# Altium schematic sheet STM32G4_microcontroller.SchDoc
size 420 x 297 mm; SheetNumber: 3; SheetTotal: 9
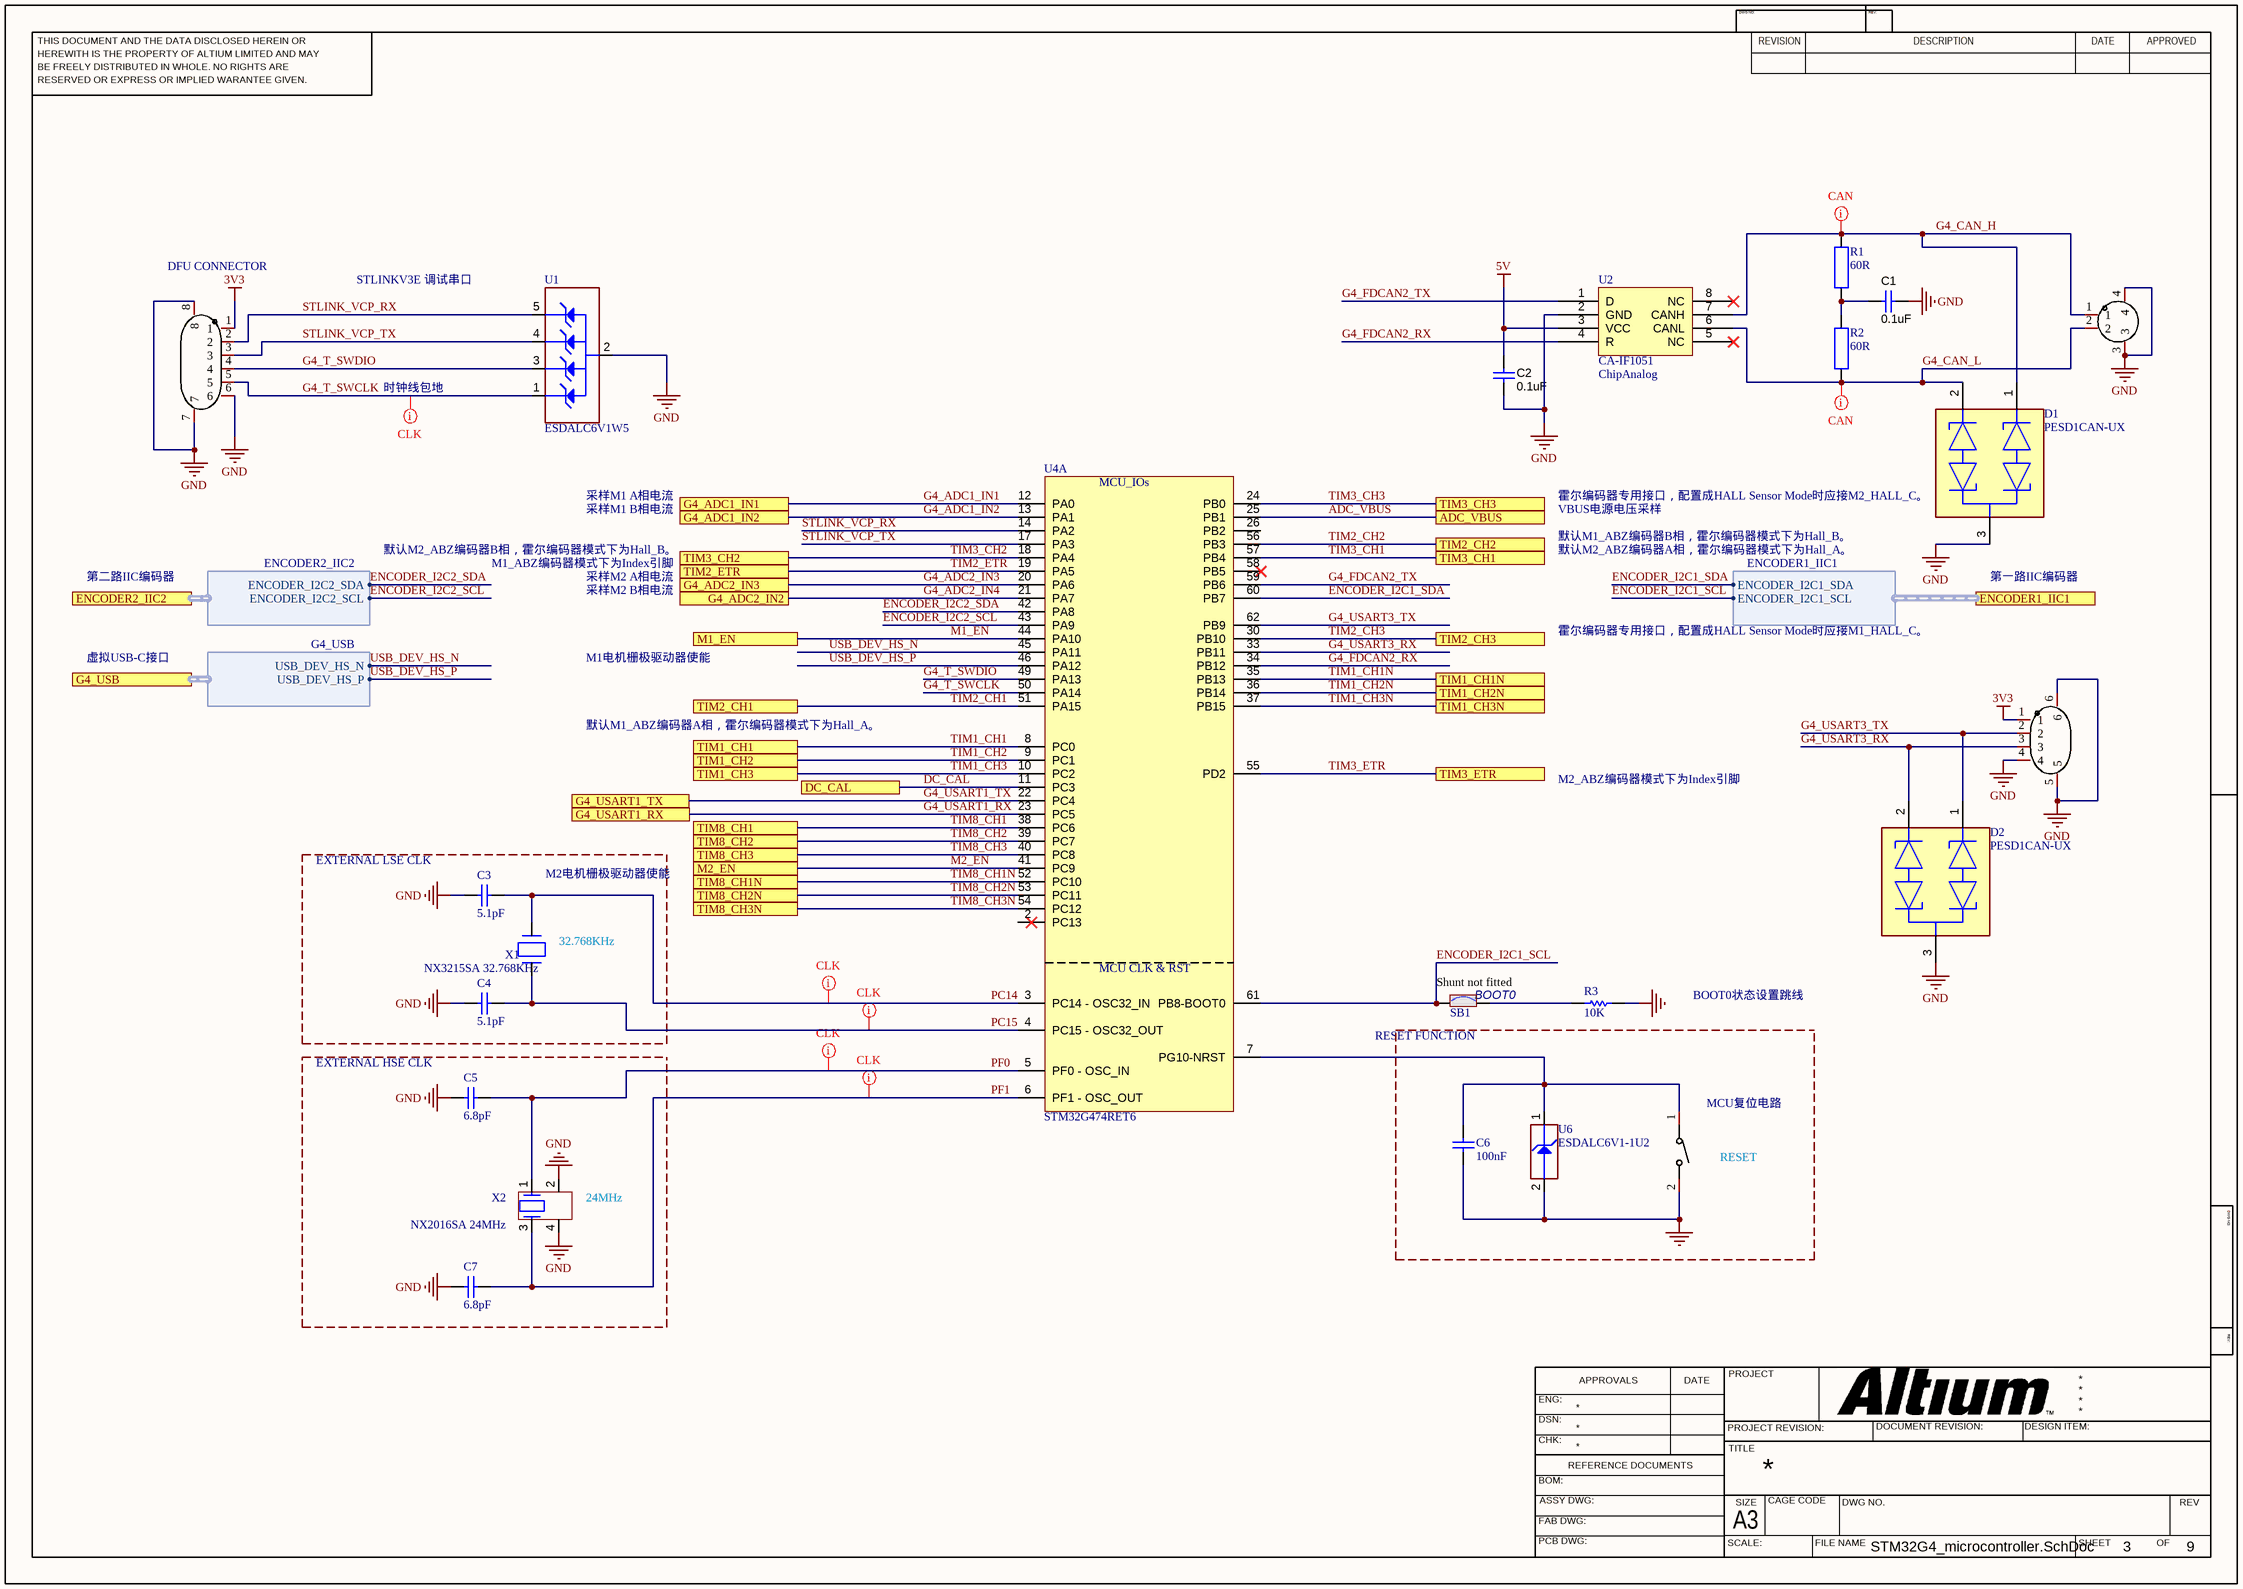
[diagram p0: STM32G4_microcontroller.SchDoc]

## Parts
C1  ValueDisplayed: 0.1uF  [0603L]  (hidden comment: GRM188R61E105KA12D)
C2  ValueDisplayed: 0.1uF  [0603L]  (hidden comment: GRM188R61E105KA12D)
C3  value 5.1pF  [C0402]
C4  value 5.1pF  [C0402]
C5  value 6.8pF  [C0402]
C6  value 100nF  [C0402]
C7  value 6.8pF  [C0402]
CN1  WAFER-GH1.25-2PWB  [CONN-TH_2P-P1.25_XUNPU_WAFER-GH1.25-2PWB]  (value not drawn)
D1  PESD1CAN-UX  [FP-SOT323-MFG]
D2  PESD1CAN-UX  [FP-SOT323-MFG]
R1  60R  [RESC1608X55N]
R2  60R  [RESC1608X55N]
R3  value 10K  [R0603]
SB1  MCD-00071  [SOLDER-BRIDGE_R0603-0R]  (value not drawn)
SW1  TS-1088-AR02016  [SW-SMD_L3.9-W3.0-P4.45]  (value not drawn)
U1  value ESDALC6V1W5  [ESD_SOT323-5L]
U2  CA-IF1051  [SOIC127P600X175-8N]
U3  WAFER-GH1.25-6PWB  [CONN-SMD_6P-P1.25_XUNPU_WAFER-GH1.25-6PWB]  (value not drawn)
U4  value STM32G474RET6  [ICC_LQFP64_10X10_P050_SOCKET_YAMAICHI_IC149-064-069-B5_NM]  (part A of 2)
U5  WAFER-GH1.25-4PWB  [CONN-SMD_4P-P1.25_XUNPU_WAFER-GH1.25-4PWB]  (value not drawn)
U6  value ESDALC6V1-1U2  [ESD_ST0201]
X1  value NX3215SA 32.768KHz  [CRY_NX3215SA_2P]
X2  value NX2016SA 24MHz  [CRY_NX2016SA_4P]

## Ports
ADC_VBUS (see STM32G4_DRV8301_hardware_TOP_V1.0[2C]), DC_CAL (see STM32G4_DRV8301_hardware_TOP_V1.0[3C], M1_DRV8301_driver[7D], M2_DRV8301_driver[8D]), ENCODER1_IIC1 (harness ENCODER1_IIC1, see STM32G4_DRV8301_hardware_TOP_V1.0[2C], DRV8301_SENSE[3E]), ENCODER2_IIC2 (harness ENCODER2_IIC2, see STM32G4_DRV8301_hardware_TOP_V1.0[2C], DRV8301_SENSE[3E]), G4_ADC1_IN1 (see STM32G4_DRV8301_hardware_TOP_V1.0[3C]), G4_ADC1_IN2 (see STM32G4_DRV8301_hardware_TOP_V1.0[3C]), G4_ADC2_IN2 (see STM32G4_DRV8301_hardware_TOP_V1.0[3C]), G4_ADC2_IN3 (see STM32G4_DRV8301_hardware_TOP_V1.0[3C]), G4_USART1_RX (see STM32G4_DRV8301_hardware_TOP_V1.0[2C]), G4_USART1_TX (see STM32G4_DRV8301_hardware_TOP_V1.0[2C]), G4_USB (harness G4_USB, see STM32G4_DRV8301_hardware_TOP_V1.0[2C], STM32G4_microcontroller_Power[3D]), M1_EN (see STM32G4_DRV8301_hardware_TOP_V1.0[3C]), M2_EN (see STM32G4_DRV8301_hardware_TOP_V1.0[3C]), TIM1_CH1 (see STM32G4_DRV8301_hardware_TOP_V1.0[3C]), TIM1_CH1N (see STM32G4_DRV8301_hardware_TOP_V1.0[3C]), TIM1_CH2 (see STM32G4_DRV8301_hardware_TOP_V1.0[3C]), TIM1_CH2N (see STM32G4_DRV8301_hardware_TOP_V1.0[3C]), TIM1_CH3 (see STM32G4_DRV8301_hardware_TOP_V1.0[3C]), TIM1_CH3N (see STM32G4_DRV8301_hardware_TOP_V1.0[3C]), TIM2_CH1 (see STM32G4_DRV8301_hardware_TOP_V1.0[2C]), TIM2_CH2 (see STM32G4_DRV8301_hardware_TOP_V1.0[2C]), TIM2_CH3 (see STM32G4_DRV8301_hardware_TOP_V1.0[2C]), TIM2_ETR (see STM32G4_DRV8301_hardware_TOP_V1.0[2C]), TIM3_CH1 (see STM32G4_DRV8301_hardware_TOP_V1.0[2C]), TIM3_CH2 (see STM32G4_DRV8301_hardware_TOP_V1.0[2C]), TIM3_CH3 (see STM32G4_DRV8301_hardware_TOP_V1.0[2C]), TIM3_ETR (see STM32G4_DRV8301_hardware_TOP_V1.0[2C]), TIM8_CH1 (see STM32G4_DRV8301_hardware_TOP_V1.0[3C]), TIM8_CH1N (see STM32G4_DRV8301_hardware_TOP_V1.0[3C]), TIM8_CH2 (see STM32G4_DRV8301_hardware_TOP_V1.0[3C]), TIM8_CH2N (see STM32G4_DRV8301_hardware_TOP_V1.0[3C]), TIM8_CH3 (see STM32G4_DRV8301_hardware_TOP_V1.0[3C]), TIM8_CH3N (see STM32G4_DRV8301_hardware_TOP_V1.0[3C])

## Harnesses
ENCODER2_IIC2: ENCODER_I2C2_SDA, ENCODER_I2C2_SCL
G4_USB: USB_DEV_HS_N, USB_DEV_HS_P
ENCODER1_IIC1: ENCODER_I2C1_SDA, ENCODER_I2C1_SCL

## Nets
3V3: U3.1 U5.1
5V: C2.1 U2.3(VCC)
GND: C1.2 C2.2 C3.2 C4.2 C5.1 C6.1 C7.1 CN1.3 CN1.4 D1.3(common_cathode) D2.3(common_cathode) R3.1 SW1.2 U1.2(GND) U2.2(GND) U3.6 U3.7 U3.8 U5.4 U5.5 U5.6 U6.2(GND) X2.2 X2.4
ADC_VBUS: U4.25(PB1) ; port ADC_VBUS
DC_CAL: U4.11(PC3) ; port DC_CAL
ENCODER_I2C1_SCL: SB1.1 U4.61(PB8-BOOT0) ; port ENCODER1_IIC1.ENCODER_I2C1_SCL
ENCODER_I2C1_SDA: U4.60(PB7) ; port ENCODER1_IIC1.ENCODER_I2C1_SDA
ENCODER_I2C2_SCL: U4.43(PA9) ; port ENCODER2_IIC2.ENCODER_I2C2_SCL
ENCODER_I2C2_SDA: U4.42(PA8) ; port ENCODER2_IIC2.ENCODER_I2C2_SDA
G4_ADC1_IN1: U4.12(PA0) ; port G4_ADC1_IN1
G4_ADC1_IN2: U4.13(PA1) ; port G4_ADC1_IN2
G4_ADC2_IN3: U4.20(PA6) ; port G4_ADC2_IN3
G4_ADC2_IN4: U4.21(PA7) ; port G4_ADC2_IN2
G4_CAN_H: CN1.1 D1.1(cathode_1) R1.2 U2.7(CANH)
G4_CAN_L: CN1.2 D1.2(cathode_2) R2.1 U2.6(CANL)
G4_FDCAN2_RX: U2.4(R) U4.34(PB12)
G4_FDCAN2_TX: U2.1(D) U4.59(PB6)
G4_T_SWCLK: U1.1(IO1) U3.5 U4.50(PA14)
G4_T_SWDIO: U1.3(IO2) U3.4 U4.49(PA13)
G4_USART1_RX: U4.23(PC5) ; port G4_USART1_RX
G4_USART1_TX: U4.22(PC4) ; port G4_USART1_TX
G4_USART3_RX: D2.2(cathode_2) U4.33(PB11) U5.3
G4_USART3_TX: D2.1(cathode_1) U4.62(PB9) U5.2
M1_EN: U4.44(PA10) ; port M1_EN
M2_EN: U4.41(PC9) ; port M2_EN
PC14: C3.1 U4.3(PC14_-_OSC32_IN) X1.2(X2)
PC15: C4.1 U4.4(PC15_-_OSC32_OUT) X1.1(X1)
PF0: C5.2 U4.5(PF0_-_OSC_IN) X2.1
PF1: C7.2 U4.6(PF1_-_OSC_OUT) X2.3
STLINK_VCP_RX: U1.5(IO4) U3.2 U4.14(PA2)
STLINK_VCP_TX: U1.4(IO3) U3.3 U4.17(PA3)
TIM1_CH1: U4.8(PC0) ; port TIM1_CH1
TIM1_CH1N: U4.35(PB13) ; port TIM1_CH1N
TIM1_CH2: U4.9(PC1) ; port TIM1_CH2
TIM1_CH2N: U4.36(PB14) ; port TIM1_CH2N
TIM1_CH3: U4.10(PC2) ; port TIM1_CH3
TIM1_CH3N: U4.37(PB15) ; port TIM1_CH3N
TIM2_CH1: U4.51(PA15) ; port TIM2_CH1
TIM2_CH2: U4.56(PB3) ; port TIM2_CH2
TIM2_CH3: U4.30(PB10) ; port TIM2_CH3
TIM2_ETR: U4.19(PA5) ; port TIM2_ETR
TIM3_CH1: U4.57(PB4) ; port TIM3_CH1
TIM3_CH2: U4.18(PA4) ; port TIM3_CH2
TIM3_CH3: U4.24(PB0) ; port TIM3_CH3
TIM3_ETR: U4.55(PD2) ; port TIM3_ETR
TIM8_CH1: U4.38(PC6) ; port TIM8_CH1
TIM8_CH1N: U4.52(PC10) ; port TIM8_CH1N
TIM8_CH2: U4.39(PC7) ; port TIM8_CH2
TIM8_CH2N: U4.53(PC11) ; port TIM8_CH2N
TIM8_CH3: U4.40(PC8) ; port TIM8_CH3
TIM8_CH3N: U4.54(PC12) ; port TIM8_CH3N
USB_DEV_HS_N: U4.45(PA11) ; port G4_USB.USB_DEV_HS_N
USB_DEV_HS_P: U4.46(PA12) ; port G4_USB.USB_DEV_HS_P
NetC1_1: C1.1 R1.1 R2.2
NetC6_2: C6.2 SW1.1 U4.7(PG10-NRST) U6.1(IO1)
NetR3_2: R3.2 SB1.2

Not connected (* = marked no-connect by the designer): U2 5(NC)* 8(NC)*; U4 2(PC13) 26(PB2) 58(PB5)*

## Layout directives
mark named CAN: G4_CAN_H, G4_CAN_L
mark named CLK: G4_T_SWCLK, PC14, PC15, PF0, PF1

## Notes on the sheet
- (near U3) DFU CONNECTOR
- STLINKV3E 调试串口
- 时钟线包地
- (near U2) ChipAnalog
- 采样M1 A相电流
- 采样M1 B相电流
- VBUS电源电压采样
- 霍尔编码器专用接口，配置成HALL Sensor Mode时应接M2_HALL_C。
- 第二路IIC编码器
- 默认M2_ABZ编码器B相，霍尔编码器模式下为Hall_B。
- M1_ABZ编码器模式下为Index引脚
- 采样M2 A相电流
- 采样M2 B相电流
- 默认M1_ABZ编码器B相，霍尔编码器模式下为Hall_B。
- 默认M2_ABZ编码器A相，霍尔编码器模式下为Hall_A。
- 第一路IIC编码器
- 虚拟USB-C接口
- M1电机栅极驱动器使能
- 霍尔编码器专用接口，配置成HALL Sensor Mode时应接M1_HALL_C。
- 默认M1_ABZ编码器A相，霍尔编码器模式下为Hall_A。
- M2_ABZ编码器模式下为Index引脚
- EXTERNAL LSE CLK
- M2电机栅极驱动器使能
- (near X1) 32.768KHz
- (near SB1) Shunt not fitted
- BOOT0
- BOOT0状态设置跳线
- EXTERNAL HSE CLK
- RESET FUNCTION
- (near SW1) MCU复位电路
- (near X2) 24MHz
- (near SW1) RESET
- THIS DOCUMENT AND THE DATA DISCLOSED HEREIN OR
- HEREWITH IS THE PROPERTY OF ALTIUM LIMITED AND MAY
- DWG NO:
- REVISION
- REV:
- DESCRIPTION
- DATE
- APPROVED
- BE FREELY DISTRIBUTED IN WHOLE. NO RIGHTS ARE
- RESERVED OR EXPRESS OR IMPLIED WARANTEE GIVEN.
- ENG:
- APPROVALS
- PROJECT
- DSN:
- CHK:
- REFERENCE DOCUMENTS
- PROJECT REVISION:
- TITLE
- DOCUMENT REVISION:
- DESIGN ITEM:
- BOM:
- FAB DWG:
- PCB DWG:
- ASSY DWG:
- SCALE:
- A3
- SIZE
- CAGE CODE
- FILE NAME
- DWG NO.
- SHEET
- OF
- REV
- (in symbol MCD-01243, part A) MCU_IOs; MCU CLK & RST

## Library data of the parts
C1 C2 = GRM188R61E105KA12D: CAP, CERM, 0.1uF, 25V, +/-10%, X5R, 0603; Manufacturer: MuRata; Polarized: N; CompType: Capacitor; Value: 1uF; U/M: EA; Cap_F: 0.000001; Tolerance_%: 10; Value1: Unknown; VDC_V: 25; TaMin_C: -55; TaMax_C: 85; Cap_Case: 0603; SymbolVersion: 2008-07-09; PartNumber: GRM188R61E105KA12D; PackageReference: 0603; RoHS: Y; Value2: 25V; MountType: SMT; Technology: Ceramic; TempCo: X5R; Published: 2008-06-19; Publisher: Texas Instruments; LatestRevisionDate: 2013-05-24; LatestRevisionNote: Changed publisher; ComponentLink1Description: Datasheet link; ComponentLink1URL: http://search.murata.co.jp/Ceramy/PnsearchViewAction.do?HnOFG=ON&HnNFG=ON&SEL_CNT=50&sLang=en&sKey=GRM188R61E105KA12D&x=9&y=9&search=startwith; Supplier 1: Digi-Key; Supplier Part Number 1: 490-3897-1-ND; Supplier 2: Mouser; Supplier Part Number 2: 81-GRM188R61E105KA12; Supplier 3: Farnell; Supplier Part Number 3: 1828802
C3 C4 = MCD-00003: Capacitor, MLCC, 5.1pF, 50V, NPO, +-0.25pF, 0402, T=0.5mm; Manufacturer_Part_Number: CC0402CRNPO9BN5R1; Manufacturer: YAGEO; ECCN_US: EAR99; ECCN_EU: NEC; Provided_By: SUBCO; Internal_Part_Number: MCD-00003; ComponentLink1Description: Datasheet; Status: Released; Part_Type: Capacitor; Package: C0402; ComponentLink1URL: http://tunmcdsvn.tun.st.com/Component_Datasheet_Library/Trunk/Capacitors/Yageo_Capacitor_NP0_16V-to-50V
C5 C7 = MCD-00674: Capacitor, MLCC, 6.8pF, 50V, NPO, +-0.25pF, 0402, T=0.5mm; Manufacturer_Part_Number: CC0402CRNPO9BN6R8; Manufacturer: YAGEO; Provided_By: SUBCO; Internal_Part_Number: MCD-00674; Status: Released; Part_Type: Capacitor; Package: C0402; ComponentLink1Description: Datasheet; ComponentLink1URL: http://tunmcdsvn.tun.st.com/Component_Datasheet_Library/Trunk/Capacitors/Yageo_Capacitor_NP0_16V-to-50V; ECCN_US: N/A; ECCN_EU: N/A
C6 = MCD-00102: Capacitor, MLCC, 100nF, 16V, X7R, 10%, 0402, T=0,5mm; Manufacturer_Part_Number: CC0402KRX7R7BB104; Manufacturer: YAGEO; Provided_By: Subcon; Initial_Board_Reference: MB1262; Internal_Part_Number: MCD-00102; Status: Released; Package: C0402; ComponentLink1Description: Yageo_Capacitor_X7R-series.pdf; ECCN_US: n/a; ECCN_EU: n/a; Part_Type: Capacitor; ComponentLink1URL: http://tunmcdsvn.tun.st.com/Component_Datasheet_Library/Trunk/Capacitors/Yageo_Multilayer_Capacitor_X7R_series_100pF_to_22uF
CN1 = WAFER-GH1.25-2PWB: Manufacturer: XUNPU(讯普); Add into BOM: yes; Pins Structure: 1x2P; Pitch: 1.25mm; Reference Series: GH; Number of PINs Per Row: 2; Current Rating (Max): 1A; Symbol: WAFER-GH1.25-2PWB; Device: WAFER-GH1.25-2PWB; LCSC Part Name: 1x2P 间距:1.25mm 卧贴 系列:GH; Supplier Part: C3029377; Manufacturer Part: WAFER-GH1.25-2PWB; Supplier Footprint: SMD,P=1.25mm,卧贴; JLCPCB Part Class: Extended Part; Datasheet: https://atta.szlcsc.com/upload/public/pdf/source/20220527/CB8773BFB0913C3B8ABD62CB38BA101A.pdf; Supplier: LCSC; Convert to PCB: yes; Mounting Style: 卧贴; Number of Pins: 2P; Number of Rows: 1; Operating Temperature Range: -25℃~+85℃
D1 D2 = CMP-14436-000006-1: TVS DIODE 24V 50V SC70-3
R1 R2 = RC0603FR-07120RL: RES SMD 60 OHM 1% 1/10W 0603; Manufacturer: Yageo; Resistance (Ohms): 120; Power (Watts): 0.1W, 1/10W; Temperature Coefficient: ±100ppm/°C; Supplier 1: Digi-Key; Supplier Part Number 1: 311-120HRCT-ND; Manufacturer Part Number: RC0603FR-07120RL; RoHS: RoHS Compliant; Category: Resistors; Stock 1: 1545282; Pricing 1: 1=0.1, 10=0.014, 25=0.01, 100=0.0057, 250=0.00436, 500=0.00348, 1000=0.00257, 2500=0.00223 (USD); Packaging: Cut Tape (CT); Tolerance: ±1%; Composition: Thick Film; Features: Moisture Resistant; Operating Temperature: -55°C ~ 155°C; Package / Case: 0603 (1608 Metric); Supplier Device Package: 0603; Size / Dimension: 0.063" L x 0.031" W (1.60mm x 0.80mm); Height: 0.022" (0.55mm); Number of Terminations: 2; ComponentLink1URL: http://www.yageo.com/documents/recent/PYu-RC_Group_51_RoHS_L_04.pdf; ComponentLink1Description: http://www.yageo.com/documents/recent/PYu-RC_Group_51_RoHS_L_04.pdf
R3 = MCD-00220: Resistor,10K,0603,1%,1/10W; Manufacturer_Part_Number: RC0603FR-0710KL; Manufacturer: YAGEO; Provided_By: Subcon; Initial_Board_Reference: MB1319; Internal_Part_Number: MCD-00220; ECCN_US: n/a; ECCN_EU: n/a; ComponentLink1Description: Yageo_Resistor_RC0603-series.pdf; Status: Released; Part_Type: Resistor; Package: R0603; ComponentLink1URL: http://tunmcdsvn.tun.st.com/Component_Datasheet_Library/Trunk/Resistors/Yageo_Resistor_RC0603-series
SB1 = MCD-00071: Solder Bridge ON; Part_Type: Mechanical; Manufacturer_Part_Number: RC0603JR-070RL; Manufacturer: YAGEO; Provided_By: SUBCO; Internal_Part_Number: MCD-00071; ECCN_US: n/a; ECCN_EU: n/a; Status: Released; Package: SB0603; ComponentLink1Description: Datasheet; ComponentLink1URL: http://tunmcdsvn.tun.st.com/Component_Datasheet_Library/Trunk/Resistors/Yageo_Resistor_RC0603-series
SW1 = TS-1088-AR02016: Manufacturer: XUNPU(讯普); Add into BOM: yes; Circuit: 单刀单掷; Actuator Style: 圆形按钮; Operating Force: 160gf; Switch Length: 4mm; Switch Width: 3mm; Switch Height: 2mm; Strike Gundam: 不带; Contact Current: 50mA; Voltage Rating (DC): 12V; Insulation Resistance: 100MΩ; Actuator/Cap Color: 黑色; Pin Style: SMD接片; Mechanical Life: 10万次; Symbol: TS-1088-AR02016; Device: TS-1088-AR02016; LCSC Part Name: 4*3*2mm 立贴 轻触开关; Supplier Part: C720477; Manufacturer Part: TS-1088-AR02016; Supplier Footprint: SMD; JLCPCB Part Class: Extended Part; Datasheet: https://atta.szlcsc.com/upload/public/pdf/source/20200810/C720475_60D09DD6C54279ADDB2DC25100F1CC11.pdf; Supplier: LCSC; Convert to PCB: yes; Mounting Style: 立贴; Operating Temperature: -30℃~+80℃
U1 = MCD-00136: Dual Transil array for ESD protection; Part_Type: Diode; Manufacturer: STMICROELECTRONICS; ECCN_US: EAR99; ECCN_EU: NEC; Provided_By: Subcon; Initial_Board_Reference: MB1262; Internal_Part_Number: MCD-00136; Status: Released; Manufacturer_Part_Number: ESDALC6V1W5; ComponentLink1Description: STM_ESD_ESDALC6V1W5.pdf; ComponentLink1URL: http://tunmcdsvn.tun.st.com/Component_Datasheet_Library/Trunk/Diodes/STM_ESD_ESDALC6V1W5
U2 = SN65HVD232D: Manufacturer: Texas Instruments; Protocol: CAN; Number of Drivers/Receivers: 1/1; Duplex: Half; Data Rate: 1Mbps; Voltage - Supply: 3 V ~ 3.6 V; Supplier 1: Digi-Key; Supplier Part Number 1: 296-26344-2-ND; RoHS: RoHS Compliant; Category: Integrated Circuits (ICs); Stock: 5000; Pricing 1: 2500=0.84375 (USD); Packaging: Tape & Reel (TR); Part Status: Active; Type: Transceiver; Operating Temperature: -40°C ~ 85°C; Mounting Type: Surface Mount; Package / Case: 8-SOIC (0.154", 3.90mm Width); Supplier Device Package: 8-SOIC; ComponentLink1URL: http://www.ti.com/lit/ds/symlink/sn65hvd230.pdf; ComponentLink1Description: http://www.ti.com/lit/ds/symlink/sn65hvd230.pdf; Supplier 2: Digi-Key; Supplier Part Number 2: 296-26344-1-ND; Pricing 2: 1=2.05, 10=1.842, 100=1.4809, 500=1.21668, 1000=1.00811 (USD); Manufacturer Part Number: CA-IF1051
U3 = WAFER-GH1.25-6PWB: Manufacturer: XUNPU(讯普); Add into BOM: yes; Pins Structure: 1x6P; Pitch: 1.25mm; Reference Series: GH; Number of PINs Per Row: 6; Current Rating (Max): 1A; Symbol: WAFER-GH1.25-6PWB; Device: WAFER-GH1.25-6PWB; LCSC Part Name: 1x6P 间距:1.25mm 卧贴 系列:GH; Supplier Part: C3029381; Manufacturer Part: WAFER-GH1.25-6PWB; Supplier Footprint: SMD,P=1.25mm,卧贴; JLCPCB Part Class: Extended Part; Datasheet: https://atta.szlcsc.com/upload/public/pdf/source/20220527/CB8773BFB0913C3B8ABD62CB38BA101A.pdf; Supplier: LCSC; Convert to PCB: yes; Mounting Style: 卧贴; Number of Pins: 6P; Number of Rows: 1; Operating Temperature Range: -25℃~+85℃
U4 = MCD-01243: STM32G474, LQFP64 package,  3D IC footprint with 2D socket footprint.; Manufacturer: STMICROELECTRONICS; BMS_Part_Number: 9175326; Provided_By: SUBCO with ST control; ECCN_US: 3A991A2; ECCN_EU: NEC; Internal_Part_Number: MCD-01243; Status: Checked; Part_Type: IC; Manufacturer_Part_Number: STM32G474RET6; Package: LQFP64; ComponentLink1Description: Datasheet; ComponentLink1URL: http://tunmcdsvn.tun.st.com/Component_Datasheet_Library/Trunk/IC/STM_MCU_STM32G4xx
U5 = WAFER-GH1.25-4PWB: Manufacturer: XUNPU(讯普); Add into BOM: yes; Pins Structure: 1x4P; Pitch: 1.25mm; Reference Series: GH; Number of PINs Per Row: 4; Current Rating (Max): 1A; Symbol: WAFER-GH1.25-4PWB; Device: WAFER-GH1.25-4PWB; LCSC Part Name: 1x4P 间距:1.25mm 卧贴 系列:GH; Supplier Part: C3029379; Manufacturer Part: WAFER-GH1.25-4PWB; Supplier Footprint: SMD,P=1.25mm,卧贴; JLCPCB Part Class: Extended Part; Datasheet: https://atta.szlcsc.com/upload/public/pdf/source/20220527/CB8773BFB0913C3B8ABD62CB38BA101A.pdf; Supplier: LCSC; Convert to PCB: yes; Mounting Style: 卧贴; Number of Pins: 4P; Number of Rows: 1; Operating Temperature Range: -25℃~+85℃
U6 = MCD-00170: ESD protection 6V1; Part_Type: Diode; Manufacturer: STMICROELECTRONICS; ECCN_US: EAR99; ECCN_EU: NEC; Provided_By: Subcon; Initial_Board_Reference: MB1274; Internal_Part_Number: MCD-00170; Status: Released; Manufacturer_Part_Number: ESDALC6V1-1U2; ComponentLink1Description: STM_ESD_ESDALC6V1-1U2.pdf; ComponentLink1URL: http://tunmcdsvn.tun.st.com/Component_Datasheet_Library/Trunk/Diodes/STM_ESD_ESDALC6V1-1U2
X1 = MCD-00091: Crystal 32.768kHz, 6pF, +-20ppm, 50Kohms max, SMD; Manufacturer_Part_Number: NX3215SA 32.768KHz EXS00A-MU00525; Manufacturer: NDK; Part_Type: Crystal_Osc; BMS_Part_Number: 9157034; ECCN_US: EAR99; ECCN_EU: NEC; Provided_By: SUBCO; Internal_Part_Number: MCD-00091; ComponentLink1Description: Datasheet; Status: Released; ComponentLink1URL: http://tunmcdsvn.tun.st.com/Component_Datasheet_Library/Trunk/Crystal_Osc/NDK_Crystal-For-ST_NX3215SA 32.768KHz EXS00A-MU00525 (EXS10B-21238); Order_Code_Digikey: 644-1386
X2 = MCD-01036: Crystal 24MHz, 6pF, +-20ppm, 80ohms max, SMD; Part_Type: Crystal_Osc; Manufacturer_Part_Number: NX2016SA 24MHz EXS00A-CS10820; Manufacturer: NDK; BMS_Part_Number: 9157045; ECCN_US: EAR99; ECCN_EU: NEC; Provided_By: SUBCO; Internal_Part_Number: MCD-01036; Status: Released; Package: (2016) 2.0 x 1.6 x 0.45 mm; ComponentLink1Description: Datasheet; ComponentLink1URL: http://tunmcdsvn.tun.st.com/Component_Datasheet_Library/Trunk/Crystal_Osc/NDK_NX2016SA 24MHz EXS00A-CS10820 (EXS10B-27366B); Order_Code_Digikey: 644-1365